# EasyEDA Pro project ProProject_MSPM0小红板_2025-07-22.epro, board 2.1
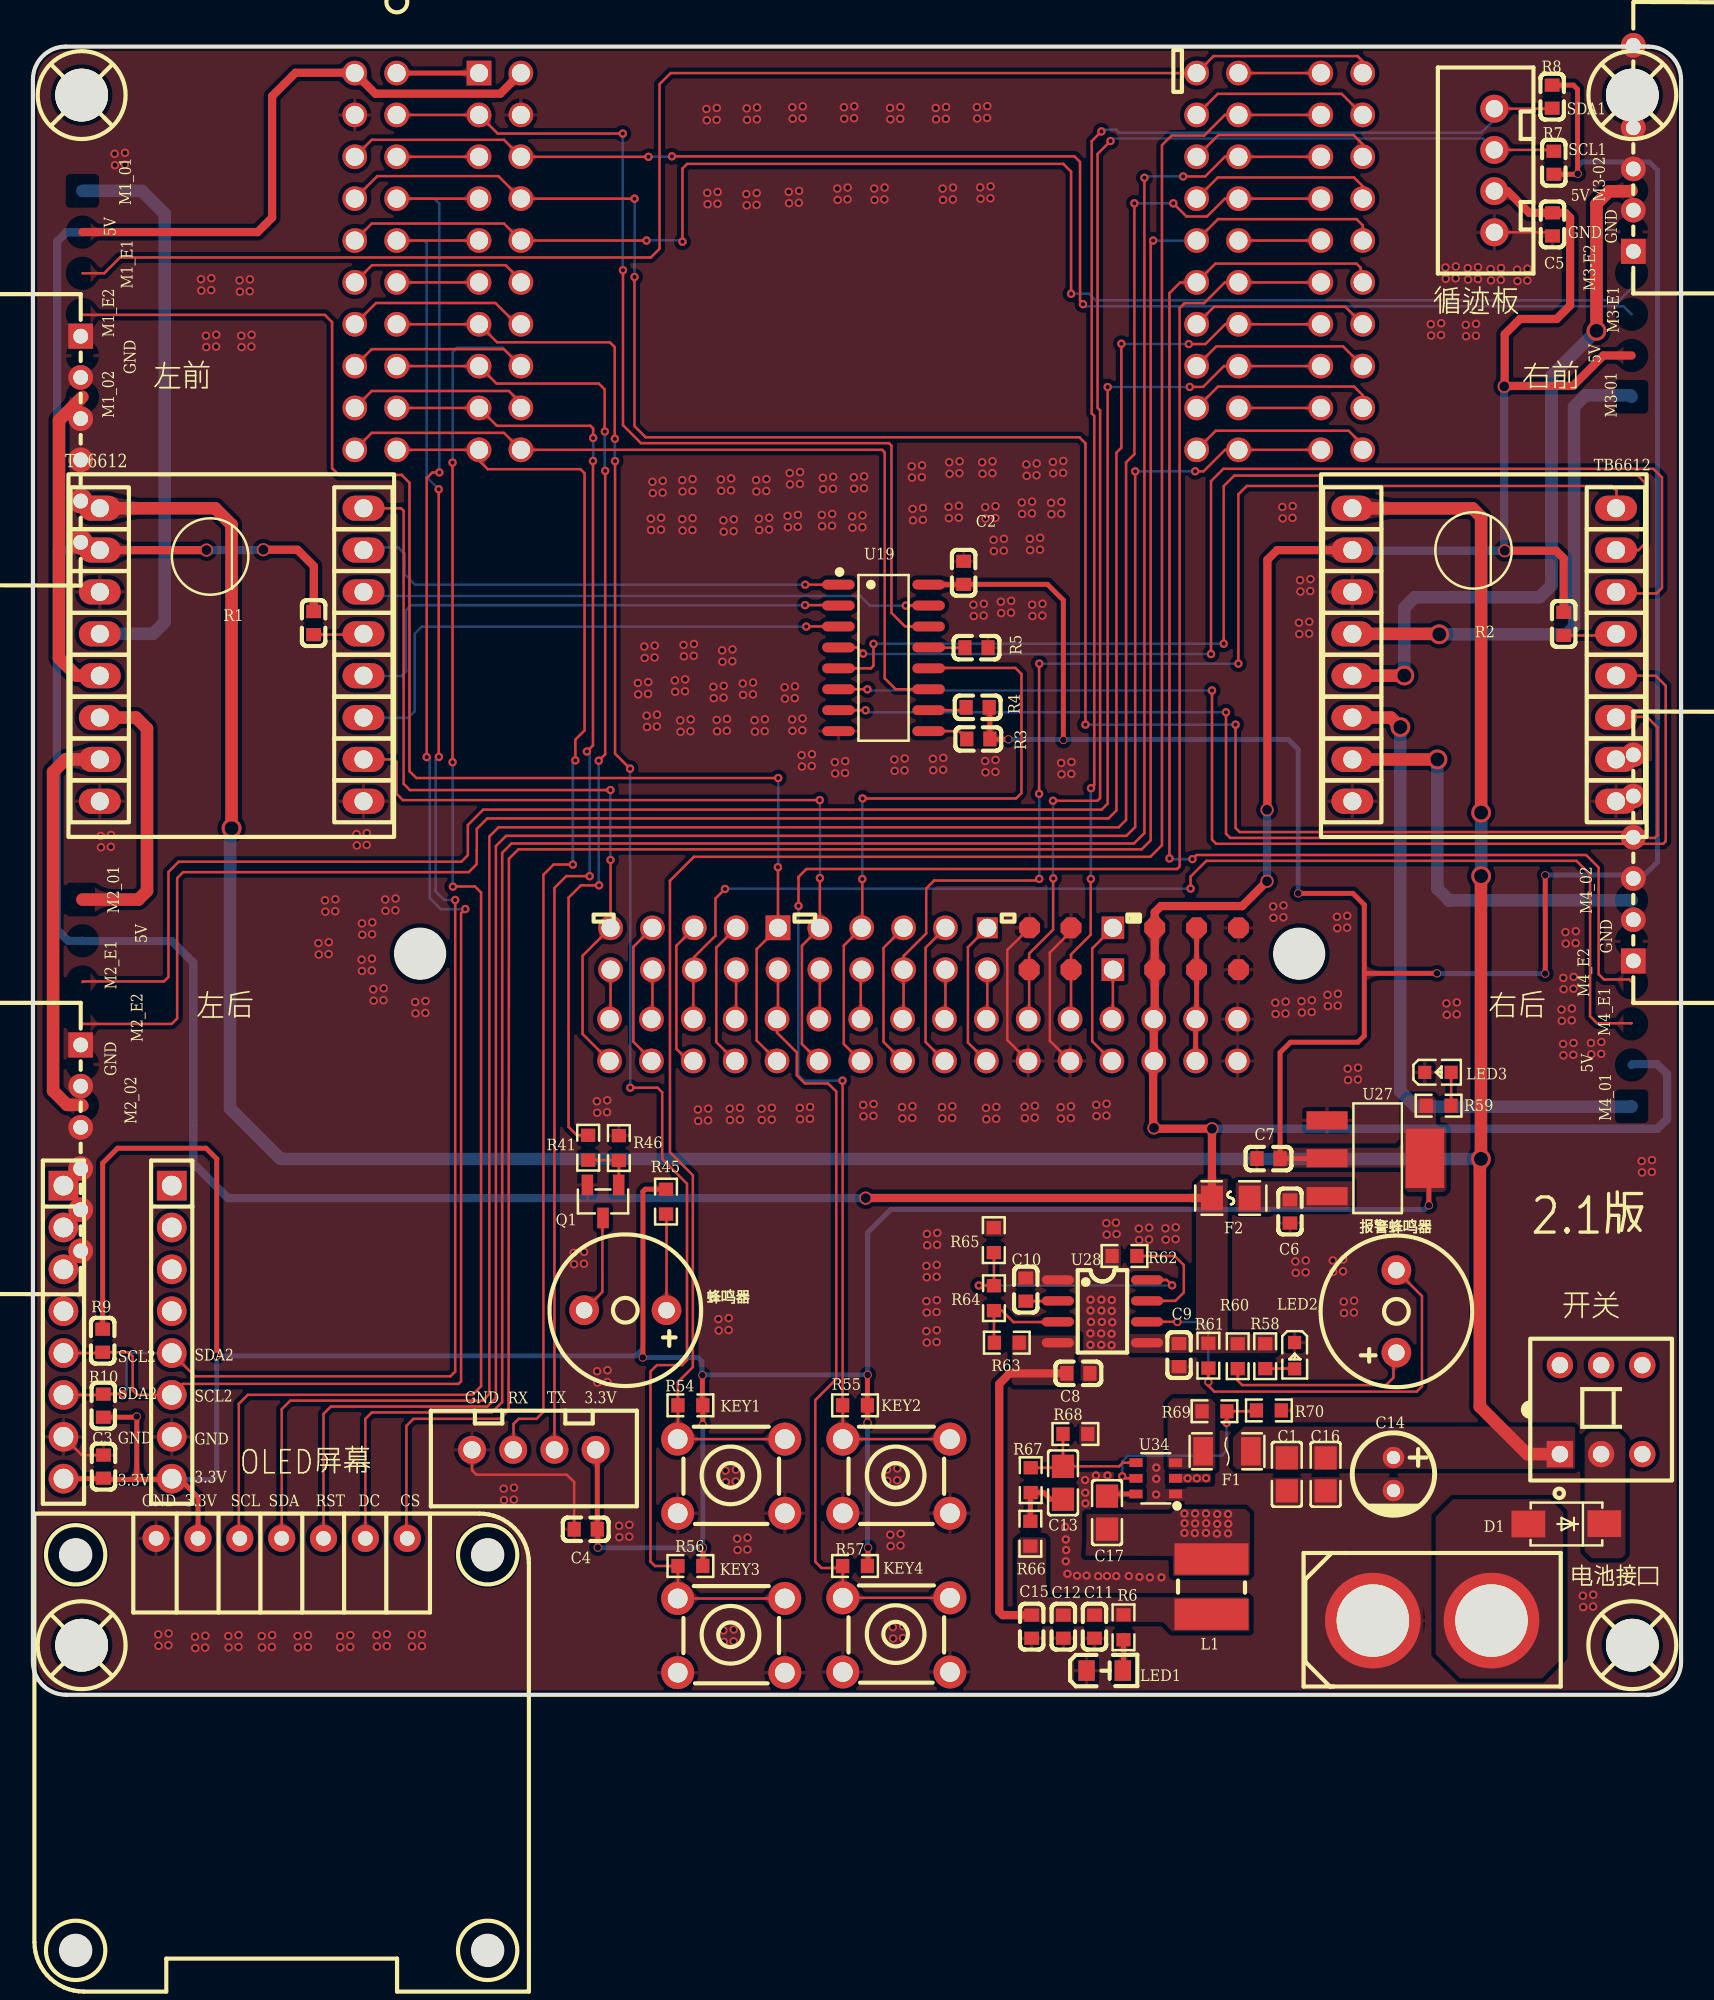
[diagram p2: board, top side]
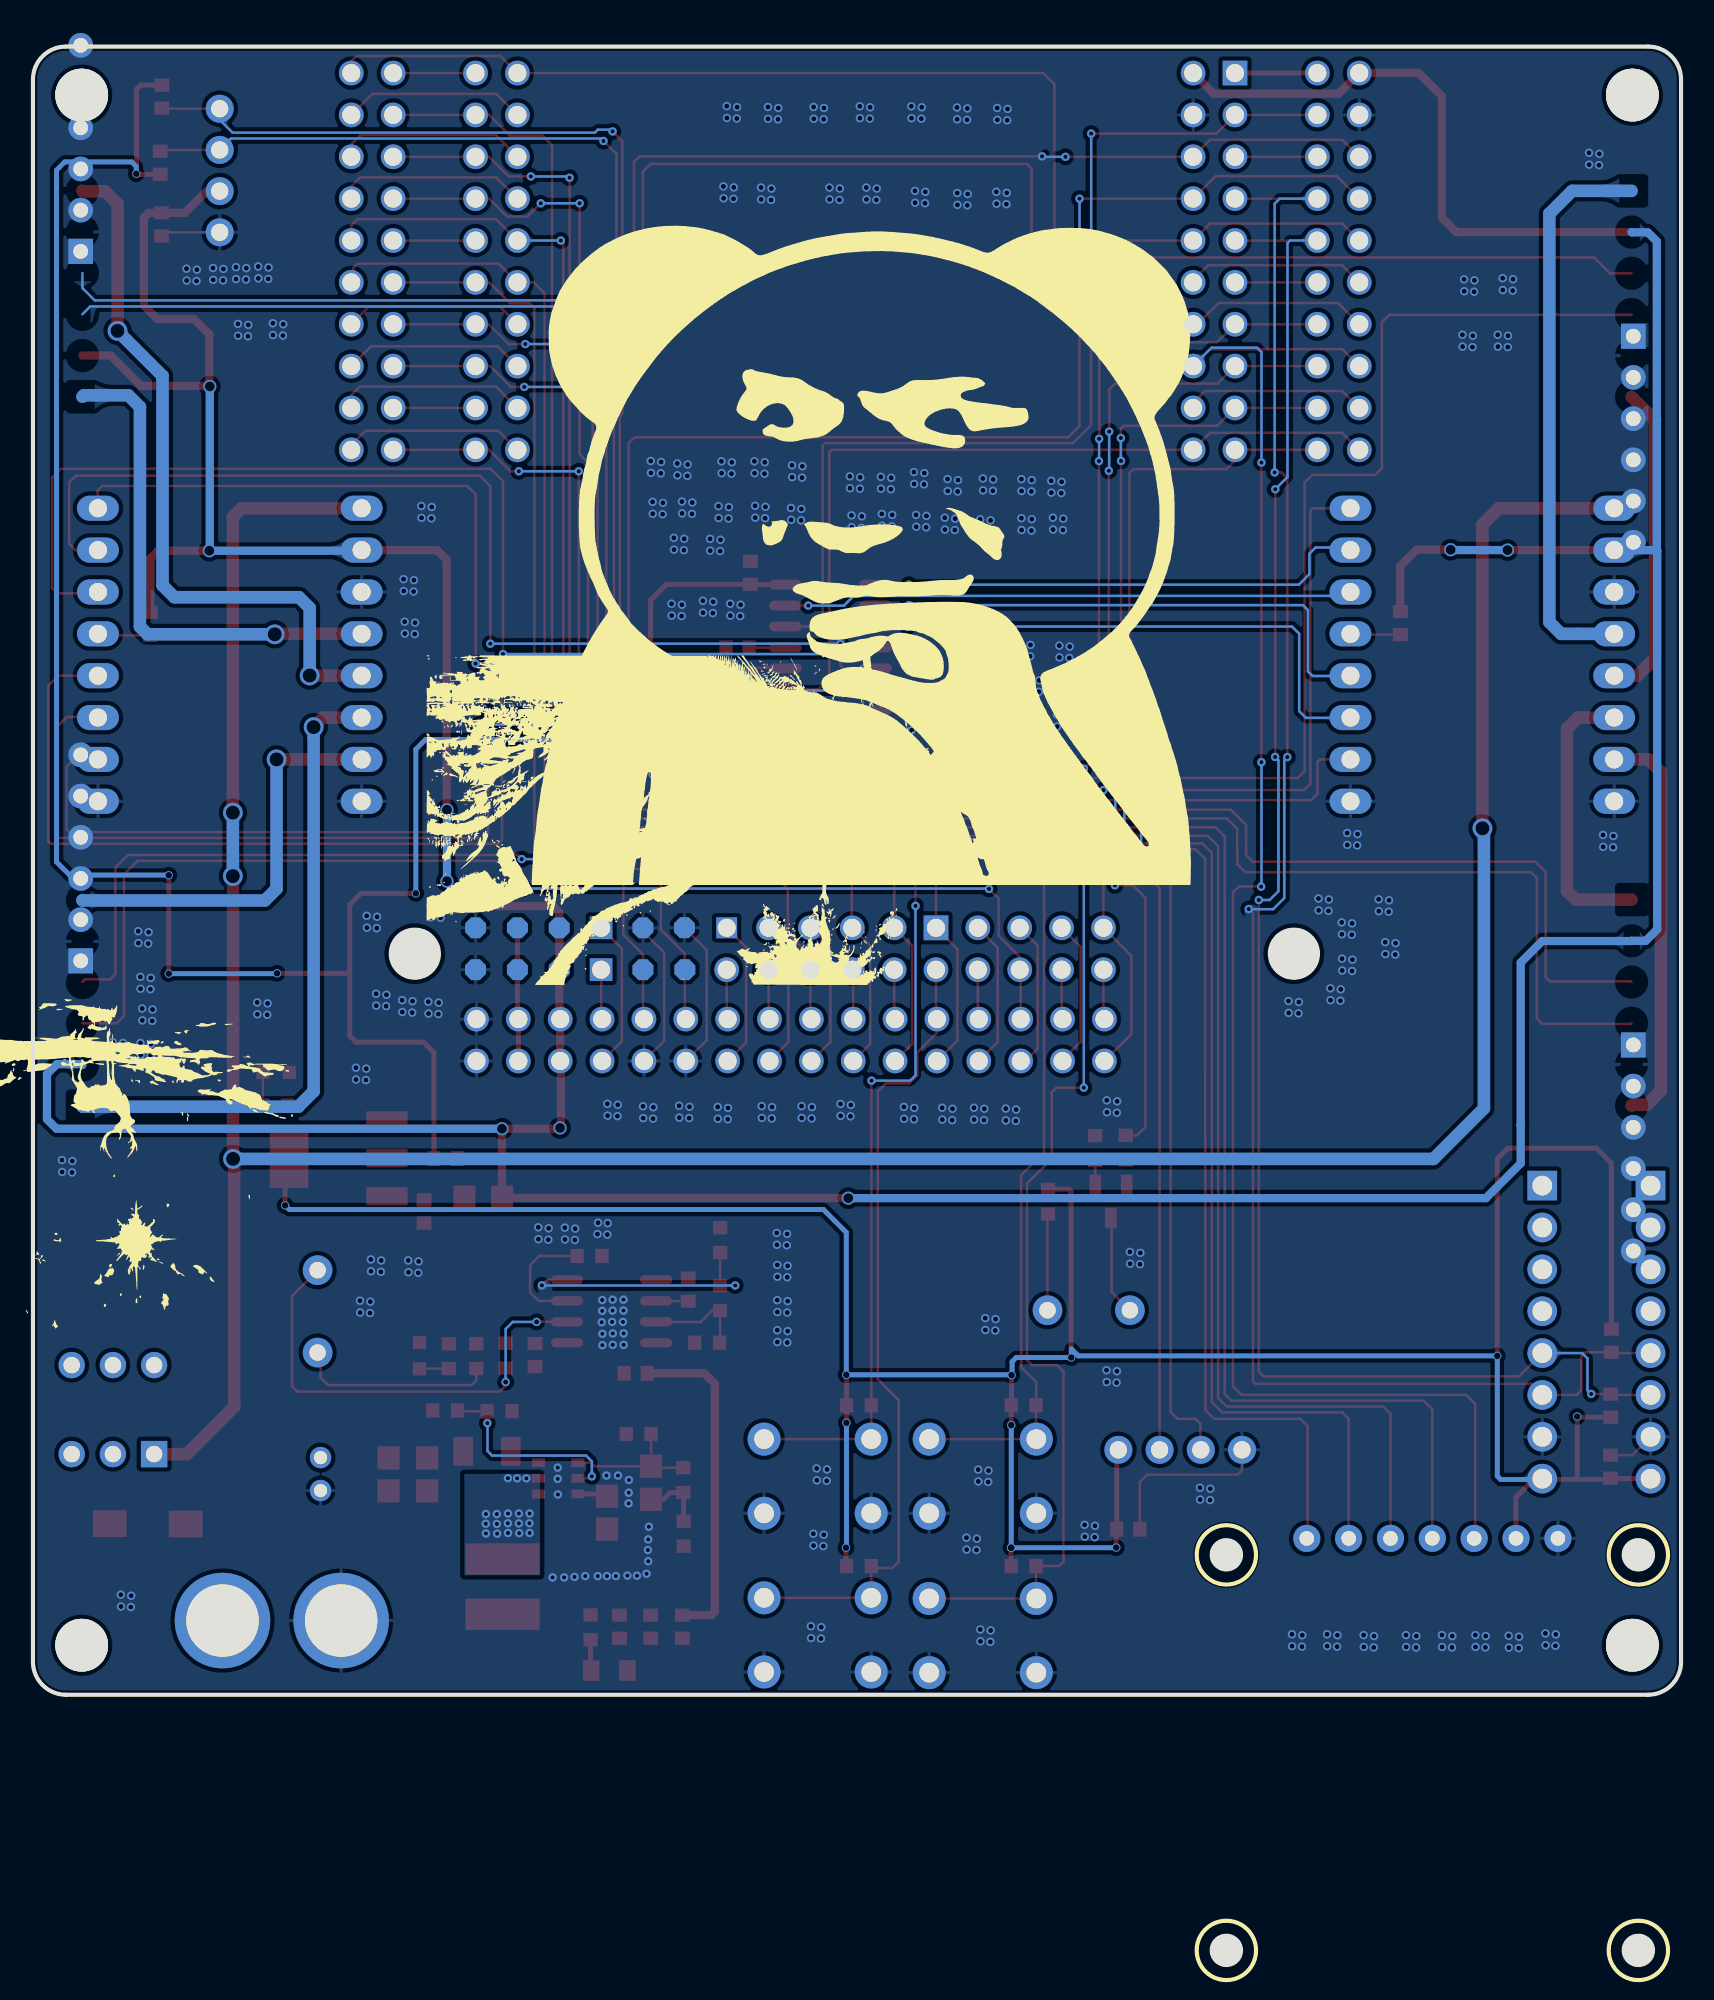
[diagram p3: board, bottom side, seen from below]

Outline 100 x 116.52 mm; copper layers: Top Layer, Bottom Layer. Coordinates in mm from the lower left corner of the outline.
Outline path: 0,114.52 0,18.52 arc(0.59,17.11) 2,16.52 98,16.52 arc(99.41,17.11) 100,18.52 100,114.52 arc(99.41,115.94) 98,116.52 2,116.52 arc(0.59,115.94) 0,114.52
Stack: Top Layer 0.035mm / Dielectric1 1.51mm FR4 er 4.5 / Bottom Layer 0.035mm

## Design rules (mm)
net 12V: 12
net +12V: 12
net DC5V: 5
net DC12V: 12
net M1_O2: 12
net 5V: 5
net M2_O2: 12
net M2_O1: 12
net M1_O1: 12
net +3.3V: 3.3
net $1N17140: 3.3
net M4_O1: 12
net M4_O2: 12
net M3_O1: 12
net M3_O2: 12
template: TI板
spacing copperThickness1oz (default): track to track 0.203, other pairs 0.152 to 0.203
spacing copperThickness2oz: track to track 0.203, other pairs 0.152 to 0.3
track width 信号线 (default): min 0.152, default 0.152, max 0.3
track width 12v: min 0.762, default 0.762, max 0.762
track width 3v3: min 0.3, default 0.3, max 0.4
track width 5电源线: min 0.5, default 0.5, max 2.54
differential pair differentialPair (default): width min 0.152, default 0.152, max 0.152; gap min 0.152, default 0.152
via 信号线孔 (default): diameter min 0.508, default 0.508, max 0.508; hole min 0.254, default 0.254, max 0.305
via 12v: diameter min 0.762, default 1.27, max 2.032; hole min 0.762, default 0.889, max 2.032
via 3v3: diameter min 0.4, default 0.6, max 1; hole min 0.4, default 0.4, max 0.6
via 5v电源: diameter min 0.5, default 0.8, max 10; hole min 0.3, default 0.6, max 6.3
net class 12 uses 12v
net class 5 uses 5v电源, 5电源线
net class 3.3 uses 3v3
net 12V uses 12v
net +12V uses 12v
net DC5V uses 5v电源, 5电源线
net DC12V uses 12v
net M1_O2 uses 12v
net 5V uses 5v电源, 5电源线
net M2_O2 uses 12v
net M2_O1 uses 12v
net M1_O1 uses 12v
net +3.3V uses 3v3
net $1N17140 uses 3v3
net M4_O1 uses 12v
net M4_O2 uses 12v
net M3_O1 uses 12v
net M3_O2 uses 12v

## Placement (name value [footprint] x y rotation side)
BUZZER3  3kHz  [BUZ-TH_BD9.0-P5.00-D0.6-FD]  35.94 39.85 180 top
BUZZER4  3kHz  [BUZ-TH_BD9.0-P5.00-D0.6-FD]  82.73 39.78 90 top
C1  100nF  [C0805]  76.08 29.89 90 top
C2  100nF  [C0603]  56.47 84.59 90 top
C3  100nF  [C0603]  4.28 30.36 270 top
C4  100nF  [C0603]  33.54 26.56 180 top
C5  100nF  [C0603]  92.2 105.73 90 top
C6  100nF  [C0603]  76.27 45.84 90 top
C7  100nF  [C0603]  74.97 49.05 0 top
C8  100nF  [C0603]  63.43 36.02 180 top
C9  100nF  [C0603]  69.54 37.13 90 top
C10  1NF  [C0603]  60.24 41.1 270 top
C11  0.1uF  [C0603]  64.41 20.65 90 top
C12  22uF  [C0603]  62.52 20.65 90 top
C13  75pf  [C0805]  62.5 29.38 270 top
C14  47uF  [CAP-TH_BD5.0-P2.00-D0.8-FD]  82.55 29.91 270 top
C15  22uF  [C0603]  60.6 20.65 90 top
C16  10uF  [C0805]  78.43 29.89 90 top
C17  100nF  [C0805]  65.17 27.57 90 top
D1  SS54  [SMA_L4.3-W2.6-LS5.0-FD]  93.04 26.89 0 top
F1  nSMD010  [F1206]  72.45 31.29 180 top
F2  SMD0805-050-24  [F0805]  72.68 46.66 0 top
H1  -  [HDR-TH_8P-P2.54-V-F-1]  8.42 38.52 270 top
H1#2  -  [HDR-TH_8P-P2.54-V-F-1]  1.85 38.52 270 top
KEY1  K3  [KEY-TH_4P-L6.0-W6.0-P4.50]  42.37 29.78 0 top
KEY2  K3  [KEY-TH_4P-L6.0-W6.0-P4.50]  52.39 29.78 0 top
KEY3  K3  [KEY-TH_4P-L6.0-W6.0-P4.50]  42.37 20.11 0 top
KEY4  K3  [KEY-TH_4P-L6.0-W6.0-P4.50]  52.39 20.15 0 top
L1  10uH  [IND-SMD_L4.5-W4.0_SCD0403T]  71.51 23.08 270 top
LED1  -  [LED_0805]  65.08 17.98 0 top
LED2  -  [LED_0603]  76.56 37.04 270 top
LED3  -  [LED_0603]  85.3 54.29 0 top
Q1  AO3400A  [SOT-23-3_L2.9-W1.3-P1.90-LS2.4-BR]  34.59 46.45 90 top
R1  10K  [C0603]  17.03 81.54 90 top
R2  10K  [C0603]  92.88 81.49 90 top
R3  10K  [C0603]  57.36 74.51 0 top
R4  10K  [C0603]  57.32 76.43 0 top
R5  10K  [C0603]  57.25 80.05 0 top
R6  5K  [R0603]  66.17 20.61 90 top
R7  4.7K  [C0603]  92.28 109.47 90 top
R8  4.7K  [C0603]  92.18 113.48 270 top
R9  4.7K  [C0603]  4.23 38 270 top
R10  4.7K  [C0603]  4.27 34.06 90 top
R41  22R  [R0603]  33.69 49.71 90 top
R45  100R  [R0603]  38.41 46.44 270 top
R46  10K  [R0603]  35.55 49.69 270 top
R54  10K  [R0603]  39.89 34.08 180 top
R55  10K  [R0603]  49.88 34.08 180 top
R56  10K  [R0603]  39.89 24.33 180 top
R57  10K  [R0603]  49.88 24.33 180 top
R58  10K  [R0603]  74.77 37.06 90 top
R59  2k  [R0603]  85.29 52.26 180 top
R60  100R  [R0603]  73.1 37.06 270 top
R61  10K  [R0603]  71.32 37.09 270 top
R62  75K  [R0603]  66.23 43.14 180 top
R63  150K  [R0603]  59.09 37.88 180 top
R64  36K  [R0603]  58.31 40.58 90 top
R65  47K  [R0603]  58.3 44.1 270 top
R66  49.9  [R0603]  60.52 26.29 270 top
R67  100K  [R0603]  60.54 29.54 270 top
R68  13.3K  [R0603]  63.25 32.34 180 top
R69  511K  [R0603]  71.69 33.72 180 top
R70  105K  [R0603]  74.99 33.77 180 top
SCREW1  -  [M3螺丝]  2.95 19.53 0 top
SCREW2  -  [M3螺丝]  97.04 113.58 0 top
SCREW3  -  [M3螺丝]  97.04 19.53 0 top
SCREW4  -  [M3螺丝]  2.95 113.58 0 top
SW1  XKB8585-Z-150  [SW-TH_6P-L8.5-W8.5-P2.50-LS5.4-BL-1]  95.15 33.82 0 top
TB6612  -  [TB6612]  78 68.52 0 top
U1  -  [MSPM0G3507]  47.48 90.02 0 top
U3  -  [TB6612]  2 68.52 0 top
U11  OLED_SPI  [0.96OLED_7P]  15.09 26.01 0 top
U18  PCA9555  [CONN-TH_4P-P2.50-XH2.54-4P]  88.67 109 270 top
U19  74HC595D,118  [SOIC-16_L9.9-W3.9-P1.27-LS6.0-BL]  51.61 79.43 270 top
U21  UART1  [CONN-TH_4P-P2.50-XH2.54-4P]  30.39 31.38 0 top
U22  -  [ZX-XH2.54-6PWZ]  3 101.52 270 top
U23  -  [ZX-XH2.54-6PWZ]  3 58.52 270 top
U24  -  [ZX-XH2.54-6PWZ]  97 101.52 90 top
U25  -  [ZX-XH2.54-6PWZ]  97 58.47 90 top
U27  A1117-3.3  [SOT-223-3_L6.5-W3.4-P2.30-LS7.0-BR-1]  81.49 49.07 180 top
U28  TPS25921ADR  [SOIC-8_L5.0-W4.0-P1.27-LS6.0-BL]  64.89 39.78 270 top
U29  XT60  [CONN-TH_XT60]  84.9 21.02 0 top
U34  TPS54302DDCT  [TSOT-23-6_L2.9-W1.6-P0.95-LS2.8-BR]  68.13 29.65 0 top

## Footprints (pads in the part's own frame, mm; a bottom-side part is the same pattern mirrored in y, then rotated)
0.96OLED_7P
  round 1.651 hole 0.889: 1(-7.617,0.003) 2(-5.077,-0.003) 3(-2.538,-0.003) 4(0.003,0.005) 5(2.54,0) 6(5.08,0) 7(7.62,-0.003)
BUZ-TH_BD9.0-P5.00-D0.6-FD
  round 1.8 hole 1: 1(-2.5,0) 2(2.5,0)
C0603
  rect 0.8x0.9 smd: 1(-0.7,0) 2(0.7,0)
C0805
  rect 1.41x1.35 smd: 1(-1,0) 2(1,0)
CAP-TH_BD5.0-P2.00-D0.8-FD
  round 1.3 hole 0.8: 1(-1,0) 2(1,0)
CONN-TH_4P-P2.50-XH2.54-4P
  round 1.7 hole 1.05: 1(3.75,0) 2(1.25,0) 3(-1.25,0) 4(-3.75,0)
CONN-TH_XT60
  round 5.8 hole 4.4: 1(-3.6,0) 2(3.6,0)
F0805
  rect 1.335x1.5 smd: 1(-1.143,0) 2(1.143,0)
F1206
  rect 1.19x1.728 smd: 1(-1.445,0) 2(1.445,0)
HDR-TH_8P-P2.54-V-F-1
  rect 1.8x1.8 hole 1.2: 1(-8.89,0)
  round 1.8 hole 1.2: 2(-6.35,0) 3(-3.81,0) 4(-1.27,0) 5(1.27,0) 6(3.81,0) 7(6.35,0) 8(8.89,0)
IND-SMD_L4.5-W4.0_SCD0403T
  rect 1.9x4.5 smd: 1(-1.675,0) 2(1.675,0)
KEY-TH_4P-L6.0-W6.0-P4.50
  round 2 hole 1.2: 1(-3.25,-2.25) 2(3.25,-2.25) 3(3.25,2.25) 4(-3.25,2.25)
LED_0603
  rect 0.8x0.8 smd: 1(-0.851,-0.01) 2(0.75,-0.005)
LED_0805
  rect 1x1.25 smd: 1(-1.15,0.005) 2(1.05,0.005)
M3螺丝
  round 3.2 hole 3.2: 1(0,0)
MSPM0G3507
  round 1.5 hole 1.1: 1(-25.412,24.892) 2(-27.952,24.892) 2(-17.872,24.892) 3(-25.412,22.352) 3(-20.412,22.352) 4(-27.952,22.352) 4(-17.872,22.352) 5(-25.412,19.812) 5(-20.412,19.812) 6(-27.952,19.812) 6(-17.872,19.812) 7(-25.412,17.272) 7(-20.412,17.272) 8(-27.952,17.272) 8(-17.872,17.272) 9(-25.412,14.732) 9(-20.412,14.732) 10(-27.952,14.732) 10(-17.872,14.732) 11(-25.412,12.192) 11(-20.412,12.192) 12(-27.952,12.192) 12(-17.872,12.192) 13(-25.412,9.652) 13(-20.412,9.652) 14(-27.952,9.652) 14(-17.872,9.652) 15(-25.412,7.112) 15(-20.412,7.112) 16(-27.952,7.112) 16(-17.872,7.112) 17(-25.412,4.572) 17(-20.412,4.572) 18(-27.952,4.572) 18(-17.872,4.572) 19(-25.412,2.032) 19(-20.412,2.032) 20(-27.952,2.032) 20(-17.872,2.033) 21(23.128,24.892) 21(33.208,24.892) 22(25.668,24.892) 22(30.668,24.892) 23(23.128,22.352) 23(33.208,22.352) 24(25.668,22.352) 24(30.668,22.352) 25(23.128,19.812) 25(33.208,19.812) 26(25.668,19.812) 26(30.668,19.812) 27(23.128,17.272) 27(33.208,17.272) 28(25.668,17.272) 28(30.668,17.272) 29(23.128,14.732) 29(33.208,14.732) 30(25.668,14.732) 30(30.668,14.732) 31(23.128,12.192) 31(33.208,12.192) 32(25.668,12.192) 32(30.668,12.192) 33(23.128,9.652) 33(33.208,9.652) 34(25.668,9.652) 34(30.668,9.652) 35(23.128,7.112) 35(33.208,7.112) 36(25.668,7.112) 36(30.668,7.112) 37(23.128,4.572) 37(33.208,4.572) 38(25.668,4.572) 38(30.668,4.572) 39(23.128,2.032) 39(33.208,2.032) 40(25.668,2.032) 40(30.668,2.032) 41(-12.49,-35.048) 41(-12.431,-26.968) 42(-12.49,-32.508) 42(-12.431,-29.508) 43(-9.95,-35.048) 43(-9.892,-26.968) 44(-9.95,-32.508) 44(-9.892,-29.508) 45(-7.41,-35.048) 45(-7.351,-26.968) 46(-7.41,-32.508) 46(-7.351,-29.508) 47(-4.87,-35.048) 47(-4.811,-26.968) 48(-4.87,-32.508) 48(-4.811,-29.508) 49(-2.33,-35.048) 50(-2.33,-32.508) 50(-2.272,-29.508) 51(0.21,-35.048) 51(0.269,-26.968) 52(0.21,-32.508) 52(0.269,-29.508) 53(2.75,-35.048) 53(2.808,-26.968) 54(2.75,-32.508) 54(2.808,-29.508) 55(5.29,-35.048) 55(5.348,-26.968) 56(5.29,-32.508) 56(5.348,-29.508) 57(7.83,-35.048) 57(7.888,-26.968) 58(7.83,-32.508) 58(7.888,-29.508) 59(10.37,-35.048) 60(10.37,-32.508) 60(10.428,-29.508) 61(12.91,-35.048) 62(12.91,-32.508) 63(15.45,-35.048) 64(15.45,-32.508) 65(17.99,-35.048) 66(17.99,-32.508) 67(20.53,-35.048) 68(20.53,-32.508) 69(23.07,-35.048) 70(23.07,-32.508) 71(25.61,-35.048) 72(25.61,-32.508)
  rect 1.5x1.5 hole 1.1: 1(-20.412,24.892) 49(-2.272,-26.968)
  rect 1.267x1.267 hole 1.1: 59(10.428,-26.968)
  custom 1.267x1.267 hole 1.1: 61(12.992,-26.962)
  custom 1.268x1.267 hole 1.1: 62(12.969,-29.508) 63(15.508,-26.968) 64(15.508,-29.508) 67(20.588,-26.968) 68(20.588,-29.508) 69(23.128,-26.968) 70(23.128,-29.508) 71(25.668,-26.968) 72(25.668,-29.508)
  rect 1.371x1.371 hole 1.1: 65(18.049,-26.968) 66(18.049,-29.508)
R0603
  rect 0.806x0.864 smd: 1(-0.753,0) 2(0.753,0)
SMA_L4.3-W2.6-LS5.0-FD
  rect 2.046x1.62 smd: 1(-2.304,-0.009) 2(2.304,0.009)
SOIC-8_L5.0-W4.0-P1.27-LS6.0-BL
  oval 0.569x1.95 smd: 1(-1.905,-2.705) 2(-0.635,-2.705) 3(0.635,-2.705) 4(1.905,-2.705) 5(1.905,2.705) 6(0.635,2.705) 7(-0.635,2.705) 8(-1.905,2.705)
SOIC-16_L9.9-W3.9-P1.27-LS6.0-BL
  oval 0.602x1.971 smd: 1(-4.445,-2.736) 2(-3.175,-2.736) 3(-1.905,-2.736) 4(-0.635,-2.736) 5(0.635,-2.736) 6(1.905,-2.736) 7(3.175,-2.736) 8(4.445,-2.736) 9(4.445,2.736) 10(3.175,2.736) 11(1.905,2.736) 12(0.635,2.736) 13(-0.635,2.736) 14(-1.905,2.736) 15(-3.175,2.736) 16(-4.445,2.736)
SOT-23-3_L2.9-W1.3-P1.90-LS2.4-BR
  rect 1.25x0.7 smd: 1(1,-0.95) 2(1,0.95) 3(-1,0)
SOT-223-3_L6.5-W3.4-P2.30-LS7.0-BR-1
  rect 2.5x1.1 smd: 1(2.97,-2.3) 2(2.97,0) 3(2.97,2.3)
  rect 2.34x3.6 smd: 2(-2.97,0)
SW-TH_6P-L8.5-W8.5-P2.50-LS5.4-BL-1
  rect 1.6x1.6 hole 1: 1(-2.5,-2.7)
  round 1.6 hole 1: 2(0,-2.7) 3(2.5,-2.7) 4(2.5,2.7) 5(0.001,2.7) 6(-2.5,2.7)
TB6612
  oval 2.54x1.524 hole 1.1: 1(2.057,19.988) 2(2.057,17.448) 3(2.057,14.908) 4(2.057,12.368) 5(2.057,9.828) 6(2.057,7.288) 7(2.057,4.748) 8(2.057,2.208) 9(18.057,2.208) 10(18.057,4.748) 11(18.057,7.288) 12(18.057,9.828) 13(18.057,12.368) 14(18.057,14.908) 15(18.057,17.448) 16(18.057,19.988)
TSOT-23-6_L2.9-W1.6-P0.95-LS2.8-BR
  rect 0.8x0.532 smd: 1(1.2,-0.95) 2(1.2,0) 3(1.2,0.95) 4(-1.2,0.95) 5(-1.2,0) 6(-1.2,-0.95)
ZX-XH2.54-6PWZ
  rect 1.524x1.5 hole 0.9: 1(2.575,-0.104)
  round 1.5 hole 0.9: 2(5.074,-0.104) 3(7.574,-0.104) 4(10.075,-0.104) 5(12.575,-0.104) 6(15.075,-0.104)

## Nets
5V: C5.2 C9.2 F2.1 R1.2 R2.2 R58.2 R60.1 R61.1 TB6612.2 U1.2 U1.67 U1.68 U3.2 U18.2 U22.2 U23.2 U24.2 U25.2 U28.5
12V: C1.2 C14.1 C16.2 F1.1 SW1.1 TB6612.1 U3.1
+3.3V: C2.1 C3.2 C4.1 C7.2 H1.8 H1#2.8 R3.2 R4.2 R7.1 R8.1 R9.1 R10.1 R45.1 R54.1 R55.1 R56.1 R57.1 R59.2 U11.2 U19.16 U21.1 U27.2
+12V: D1.2 SW1.2
GND: C1.1 C2.2 C3.1 C4.2 C5.1 C6.1 C7.1 C8.1 C9.1 C10.1 C11.1 C12.1 C14.2 C15.1 C16.1 H1.7 H1#2.7 KEY1.1 KEY1.2 KEY2.1 KEY2.2 KEY3.1 KEY3.2 KEY4.1 KEY4.2 LED1.1 LED2.1 LED3.1 Q1.2 R5.2 R46.1 R62.2 R65.1 R68.1 R70.1 TB6612.3 TB6612.8 TB6612.9 U1.4 U1.61 U1.63 U1.71 U1.72 U3.3 U3.8 U3.9 U11.1 U18.1 U19.8 U21.4 U22.5 U23.5 U24.5 U25.5 U27.1 U28.1 U29.1 U34.1
595DS: U1.3 U19.14
595SHCP: U1.20 U19.11
595STCP: U1.53 U19.12
BEEP: R41.2 U1.15
DC5V: C8.2 C11.2 C12.2 C15.2 L1.2 R6.2 R63.1 R66.2 U28.4
DC12V: D1.1 U29.2
EN: R69.1 R70.2 U34.5
ENUV: R63.2 R64.1 U28.3
FB: C13.1 R67.1 R68.2 U34.4
KEY1: KEY1.3 KEY1.4 R54.2 U1.24
KEY2: KEY2.3 KEY2.4 R55.2 U1.32
KEY3: KEY3.3 KEY3.4 R56.2 U1.13
KEY4: KEY4.3 KEY4.4 R57.2 U1.50
M1_E1: U1.21 U22.3
M1_E2: U1.49 U22.4
M1_IN1: U3.14 U19.15
M1_IN2: U3.15 U19.1
M1_O1: U3.4 U22.1
M1_O2: U3.5 U22.6
M1_PWM: U1.41 U3.16
M2_E1: U1.36 U23.3
M2_E2: U1.34 U23.4
M2_IN1: U3.12 U19.2
M2_IN2: U3.11 U19.3
M2_O1: U3.6 U23.1
M2_O2: U3.7 U23.6
M2_PWM: U1.51 U3.10
M3_E1: U1.6 U24.3
M3_E2: U1.10 U24.4
M3_IN1: TB6612.14 U19.4
M3_IN2: TB6612.15 U19.5
M3_O1: TB6612.4 U24.1
M3_O2: TB6612.5 U24.6
M3_PWM: TB6612.16 U1.56
M4_E1: U1.46 U25.3
M4_E2: U1.31 U25.4
M4_IN1: TB6612.12 U19.6
M4_IN2: TB6612.11 U19.7
M4_O1: TB6612.6 U25.1
M4_O2: TB6612.7 U25.6
M4_PWM: TB6612.10 U1.8
OLED_CS: U1.29 U11.7
OLED_DC: U1.26 U11.6
OLED_RST: U1.40 U11.5
OLED_SCL: U1.16 U11.3
OLED_SDA: U1.28 U11.4
OVP: R64.2 R65.2 U28.8
RX1: U1.19 U21.3
SCL1: R7.2 U1.62 U18.3
SCL2: H1.6 H1#2.5 R9.2 U1.7
SDA1: R8.2 U1.64 U18.4
SDA2: H1.5 H1#2.6 R10.2 U1.9
SW: C17.1 L1.1 U34.2
TX1: U1.17 U21.2
$1N3300: R1.1 U3.13
$1N3306: R2.1 TB6612.13
$1N3954: R3.1 U19.9
$1N3999: R4.1 U19.10
$1N4038: R5.1 U19.13
$1N7178: Q1.1 R41.1 R46.2
$1N9172: LED2.2 R58.1
$1N14720: BUZZER3.1 R45.2
$1N14723: BUZZER3.2 Q1.3
$1N15095: LED3.2 R59.1
$1N16674: C17.2 U34.6
$1N16686: F1.2 R69.2 U34.3
$1N17004: C13.2 R66.1 R67.2
$1N17013: LED1.2 R6.1
$1N17140: C6.2 F2.2 U27.3
$1N22095: BUZZER4.1 R60.2
$1N22604: C10.2 U28.2
$1N22844: R62.1 U28.7
$1N22851: BUZZER4.2 R61.2 U28.6

Pads without a net: H1 1 2 3 4; H1#2 1 2 3 4; SCREW1 1; SCREW2 1; SCREW3 1; SCREW4 1; SW1 3 4 5 6; U1 1 5 11 12 14 18 22 23 25 27 30 33 35 37 38 39 42 43 44 45 47 48 52 54 55 57 58 59 60 65 66 69 70

## Via types
v1: diameter 0.508, hole 0.305, Top Layer to Bottom Layer, 562 vias
v2: diameter 0.508, hole 0.254, Top Layer to Bottom Layer, 142 vias
v3: diameter 1.2, hole 0.85, Top Layer to Bottom Layer, 9 vias
v4: diameter 0.8, hole 0.6, Top Layer to Bottom Layer, 9 vias
v5: diameter 0.5, hole 0.4, Top Layer to Bottom Layer, 11 vias
v6: diameter 0.508, hole 0.4, Top Layer to Bottom Layer, 8 vias

## Routing (per net, layer and track width the routed paths; a pad name or vN(x,y) marks a point on that pad's centre or on a via; arc(x,y) is an arc through that point)
5V: length 322.1
  Top Layer w0.5: 89.3,95.93 89.3,99.06 90.23,99.99 92.45,99.99 93.27,100.81 93.27,106.14 92.98,106.43 C5.2 90.79,106.43 89.47,107.75 U18.2 ; 89.3,95.93 v4(89.27,95.9) ; 89.3,95.93 93.44,95.93 95.29,97.78 97,97.78 ; R1.2 17.04,82.25 17.04,85 16.05,85.99 v4(13.98,85.99) ; R2.2 92.88,85.47 92.42,85.93 v4(89.3,85.93) ; U3.2 10.53,85.97 v4(10.53,85.97) ; U1.2 28.35,113.66 20.78,113.66 U1.2 19.51,114.93 15.93,114.93 14.51,113.51 14.51,106.14 13.63,105.27 3,105.27 ; v4(74.88,65.88) 73.37,64.37 68.44,64.37 68.07,64 U1.67 U1.68 68.07,57.57 U1.68 U1.67 67.97,54.94 67.97,50.86 v4(71.54,50.86) 71.54,50.86 F2.1 50.54,46.66 v4(50.53,46.65) ; TB6612.2 75.49,85.97 74.9,85.38 74.9,70.23 v4(74.88,70.21)
  Bottom Layer w0.5: 1.45,85.86 1.45,85.97 1.47,85.97 ; 1.45,85.86 1.47,85.97 ; 1.45,85.86 1.45,62.95 2.14,62.27 3,62.27 3.01,62.25 8.42,62.25 9.73,60.94 9.73,51.07 ; v4(10.53,85.97) 13.96,85.97 v4(13.98,85.99) ; 1.47,85.97 1.47,104.7 2.02,105.25 2.99,105.25 3,105.27 ; 1.47,85.97 U3.2 ; 9.73,51.07 9.71,51.09 ; 9.73,51.07 9.73,48.76 11.84,46.65 v4(50.53,46.65) ; TB6612.2 80.1,85.93 v4(89.3,85.93) 89.27,85.96 v4(89.27,95.9) ; v4(74.88,70.21) v4(74.88,65.88) ; 97,54.73 97.05,54.78 98.55,54.78 99.15,54.18 99.15,51.44 98.57,50.86 v4(71.54,50.86)
  vias: v4(68.02,50.91)
12V: length 189.1
  Top Layer w0.762: U3.1 11.05,88.51 12.05,87.51 v3(12.05,69.09) ; SW1.1 90.67,31.12 87.79,34 87.79,48.96 v3(87.86,49.03) 87.86,66.18 v3(87.87,66.19) ; TB6612.1 80.07,88.5 87.35,88.5 87.87,87.98 v3(87.87,70.04)
  Bottom Layer w0.762: v3(87.87,66.19) v3(87.87,70.04) ; 4.07,88.52 U3.1 ; v3(12.05,69.09) 11.96,69 11.96,52.09 15.02,49.03 v3(87.86,49.03)
+3.3V: length 344.9
  Top Layer w0.3: R56.1 40.65,24.34 v6(40.65,25.44) ; R8.1 93.47,114.18 93.72,113.93 93.72,108.77 R7.1 ; v6(40.62,35.91) 40.62,34.1 R54.1 40.64,32.88 v6(40.64,32.88) ; R10.1 6.26,33.36 v5(6.3,33.4) 6.3,29.62 ; v6(34.27,25.45) 34.27,26.53 C4.1 34.24,31.28 U21.1 ; v5(91.76,66.24) v5(91.76,60.27) ; v5(62.52,74.45) 62.52,82.93 61.56,83.89 C2.1 56.45,83.88 U19.16 ; v5(84.7,46.21) 84.7,48.83 U27.2 ; R4.2 58.06,76.39 R3.2 58.08,74.49 v5(59.19,74.49) ; U27.2 78.5,49.05 C7.2 75.67,55.48 76.3,56.11 80.39,56.11 80.78,56.5 80.78,64.45 80.09,65.14 v5(76.77,65.14) ; v5(37,36.98) 37.01,36.99 37.01,47.05 37.15,47.19 R45.1 ; H1#2.8 4.25,29.63 C3.2 ; 4.3,29.58 8.94,29.58 10.02,28.5 10.02,26.01 U11.2 ; v5(11.15,37.08) 11.15,49.03 10.5,49.68 5.13,49.68 4.23,48.78 R9.1 ; v5(85.19,60.29) 80.79,60.29 ; v6(50.67,25.44) 50.67,24.37 R57.1 ; v6(50.64,33.02) 50.63,33.03 R55.1 50.63,35.91 v6(50.65,35.93)
  Bottom Layer w0.3: H1.8 8.47,29.58 10.94,29.58 11.15,29.79 v5(11.15,37.08) 36.57,37.08 36.99,37.5 36.99,36.99 v5(37,36.98) 40.34,36.98 40.59,36.73 40.59,35.94 v6(40.62,35.91) 40.64,35.93 v6(50.65,35.93) 50.65,44.57 52.04,45.96 84.45,45.96 v5(84.7,46.21) ; v5(91.76,66.24) 91.77,66.25 97.77,66.25 98.57,67.05 98.57,109.02 98.07,109.52 94.01,109.52 93.73,109.24 v5(93.73,108.8) 93.72,108.81 ; v5(59.19,74.49) 59.2,74.48 76.17,74.48 76.77,73.88 v5(76.77,65.14) ; v5(91.76,60.27) 85.21,60.27 v5(85.19,60.29) ; v6(34.27,25.45) 34.28,25.44 v6(40.65,25.44) 40.64,25.45 v6(40.64,32.88) ; v6(50.67,25.44) 50.64,25.47 v6(50.64,33.02)
GND: length 35.4
  Top Layer w0.152: C5.1 91.98,105.25 U18.1 ; U1.63 62.99,62.84 61.7,61.55 61.7,56.2 U1.63 ; U21.4 26.64,30.14 26.91,29.87 32.39,29.87 32.84,29.42 C4.2 ; H1#2.7 2.96,31.06 C3.1 ; U1.61 59.12,56.24 59.12,61.71 U1.61
  vias: v1(4.11,68.63) v1(4.12,67.94) v1(4.73,68.69) v1(4.73,67.97) v1(4.95,110.02) v1(4.98,109.33) v1(5.59,110.08) v1(5.58,109.36) v1(7.6,20.18) v1(7.62,19.49) v1(8.22,19.52) v1(8.23,20.24) v1(9.83,20.04) v1(9.85,19.35) v1(10.2,102.41) v1(10.22,101.72) v1(10.5,98.98) v1(10.52,98.29) v1(10.46,20.1) v1(10.45,19.38) v1(10.81,101.75) v1(10.83,102.47) v1(11.11,98.32) v1(11.12,99.04) v1(11.85,20.08) v1(11.87,19.39) v1(12.48,20.14) v1(12.47,19.42) v1(12.53,102.34) v1(12.56,101.65) v1(12.64,98.98) v1(12.66,98.29) v1(13.17,102.4) v1(13.16,101.68) v1(13.27,99.04) v1(13.25,98.32) v1(13.88,20.08) v1(13.9,19.39) v1(14.51,20.14) v1(14.5,19.42) v1(16.06,20.08) v1(16.08,19.39) v1(16.69,20.14) v1(16.68,19.42) v1(17.32,62.12) v1(17.34,61.43) v1(17.72,64.72) v1(17.74,64.03) v1(17.95,62.18) v1(17.94,61.46) v1(18.35,64.78) v1(18.34,64.06) v1(18.63,20.08) v1(18.65,19.39) v1(19.26,20.14) v1(19.25,19.42) v1(19.63,68.74) v1(19.65,68.05) v1(19.96,63.32) v1(19.98,62.63) v1(19.94,61.12) v1(19.96,60.43) v1(20.26,68.8) v1(20.25,68.08) v1(20.59,63.38) v1(20.58,62.66) v1(20.57,61.18) v1(20.56,60.46) v1(20.65,59.32) v1(20.67,58.63) v1(20.85,20.13) v1(20.87,19.44) v1(21.28,59.38) v1(21.27,58.66) v1(21.37,64.77) v1(21.39,64.08) v1(21.48,20.19) v1(21.47,19.47) v1(22,64.83) v1(21.99,64.11) v1(22.98,20.13) v1(23,19.44) v1(23.19,58.55) v1(23.21,57.86) v1(23.61,20.19) v1(23.6,19.47) v1(23.81,57.89) v1(23.82,58.61) v1(28.56,29.02) v1(28.58,28.33) v1(29.19,29.08) v1(29.18,28.36) v1(32.81,43.33) v1(32.83,42.64) v1(33.44,43.39) v1(33.43,42.67) v1(34.21,52.53) v1(34.23,51.84) v1(34.23,36.15) v1(34.25,35.46) v1(34.85,52.59) v1(34.83,51.87) v1(34.86,36.21) v1(34.85,35.49) v1(35.56,26.77) v1(35.58,26.08) v1(36.19,26.83) v1(36.18,26.11) v1(36.7,77.91) v1(36.73,77.22) v1(37.1,80.12) v1(37.11,79.43) v1(37.23,75.93) v1(37.26,75.24) v1(37.33,77.97) v1(37.33,77.25) v1(37.48,87.88) v1(37.51,87.19) v1(37.58,90.12) v1(37.61,89.43) v1(37.71,79.46) v1(37.73,80.18) v1(37.86,75.99) v1(37.86,75.27) v1(38.11,87.94) v1(38.11,87.22) v1(38.21,90.18) v1(38.2,89.46) v1(38.95,78.07) v1(38.96,77.38) v1(39.27,75.64) v1(39.3,74.95) v1(39.39,90.22) v1(39.42,89.53) v1(39.39,87.85) v1(39.42,87.16) v1(39.48,80.22) v1(39.49,79.53) v1(39.58,78.13) v1(39.57,77.41) v1(39.91,75.7) v1(39.89,74.98) v1(40.02,89.56) v1(40.02,87.19) v1(40.02,90.28) v1(40.02,87.91) v1(40.11,80.28) v1(40.1,79.56) v1(40.35,52.03) v1(40.36,51.34) v1(40.86,112.74) v1(40.89,112.05) v1(40.92,107.65) v1(40.93,106.96) v1(40.98,52.09) v1(40.96,51.37) v1(41.29,77.68) v1(41.3,76.99) v1(41.49,112.8) v1(41.48,112.08) v1(41.48,75.67) v1(41.51,74.98) v1(41.55,107.71) v1(41.54,106.99) v1(41.59,39.31) v1(41.61,38.62) v1(41.73,90.26) v1(41.76,89.57) v1(41.82,79.89) v1(41.89,87.78) v1(41.92,87.09) v1(41.83,79.2) v1(41.92,77.74) v1(41.91,77.02) v1(41.89,20.42) v1(41.91,19.73) v1(42.02,30.12) v1(42.11,75.73) v1(42.11,75.01) v1(42.04,29.43) v1(42.21,38.65) v1(42.27,52.08) v1(42.3,51.39) v1(42.22,39.37) v1(42.36,90.32) v1(42.36,89.6) v1(42.52,87.12) v1(42.45,79.95) v1(42.43,79.23) v1(42.52,20.48) v1(42.51,19.76) v1(42.52,87.84) v1(42.65,30.18) v1(42.64,29.46) v1(42.73,25.99) v1(42.75,25.3) v1(42.91,52.14) v1(42.89,51.42) v1(43.07,77.88) v1(43.08,77.19) v1(43.3,112.77) v1(43.29,107.58) v1(43.3,106.89) v1(43.33,112.08) v1(43.36,26.05) v1(43.35,25.33) v1(43.7,77.94) v1(43.68,77.22) v1(43.79,75.65) v1(43.8,74.96) v1(43.92,107.64) v1(43.91,106.92) v1(43.88,90.22) v1(43.89,89.53) v1(43.93,112.83) v1(43.92,112.11) v1(44.05,87.88) v1(44.07,87.19) v1(44.2,52.08) v1(44.23,51.39) v1(44.42,75.71) v1(44.41,74.99) v1(44.51,90.28) v1(44.49,89.56) v1(44.67,87.94) v1(44.67,87.22) v1(44.83,52.14) v1(44.83,51.42) v1(45.61,77.65) v1(45.63,76.96) v1(45.79,88.05) v1(45.8,87.36) v1(45.86,107.71) v1(45.88,107.02) v1(45.92,90.65) v1(45.93,89.96) v1(46.08,112.84) v1(46.1,112.15) v1(46.07,75.7) v1(46.08,75.01) v1(46.23,77.71) v1(46.23,76.99) v1(46.42,88.11) v1(46.41,87.39) v1(46.48,107.77) v1(46.48,107.05) v1(46.55,90.71) v1(46.54,89.99) v1(46.52,52.13) v1(46.55,51.44) v1(46.7,112.9) v1(46.7,112.18) v1(46.7,75.76) v1(46.68,75.04) v1(46.64,73.53) v1(46.66,72.84) v1(47.16,52.19) v1(47.14,51.47) v1(47.27,73.59) v1(47.26,72.87) v1(47.86,88.11) v1(47.89,87.42) v1(47.92,90.36) v1(47.95,89.67) v1(48.49,88.17) v1(48.48,87.45) v1(48.55,90.42) v1(48.55,89.7) v1(48.66,73.11) v1(48.67,72.42) v1(48.8,107.91) v1(48.83,107.22) v1(49.2,112.84) v1(49.23,112.15) v1(49.29,73.17) v1(49.27,72.45) v1(49.43,107.97) v1(49.42,107.25) v1(49.7,88.02) v1(49.8,90.39) v1(49.73,87.33) v1(49.83,112.9) v1(49.83,112.18) v1(49.83,89.7) v1(50.33,88.08) v1(50.33,87.36) v1(50.38,52.31) v1(50.39,51.62) v1(50.43,90.45) v1(50.42,89.73) v1(51.01,52.37) v1(50.99,51.65) v1(51.05,107.91) v1(51.07,107.22) v1(51.67,107.97) v1(51.67,107.25) v1(51.82,30.19) v1(51.84,29.5) v1(52.01,112.8) v1(52.02,26.23) v1(52.02,112.11) v1(52.04,25.54) v1(52.17,20.62) v1(52.19,19.93) v1(52.27,73.27) v1(52.29,72.58) v1(52.45,30.25) v1(52.44,29.53) v1(52.64,112.86) v1(52.63,112.14) v1(52.65,26.29) v1(52.64,25.57) v1(52.73,52.18) v1(52.76,51.49) v1(52.8,20.68) v1(52.79,19.96) v1(52.89,73.33) v1(52.89,72.61) v1(53.32,91.06) v1(53.33,90.37) v1(53.38,88.47) v1(53.39,87.78) v1(53.36,52.24) v1(53.36,51.52) v1(53.95,91.12) v1(53.93,90.4) v1(54.01,88.53) v1(53.99,87.81) v1(54.21,42.54) v1(54.21,40.4) v1(54.21,38.58) v1(54.24,44.48) v1(54.26,43.79) v1(54.23,41.85) v1(54.23,39.71) v1(54.23,37.89) v1(54.61,73.31) v1(54.63,72.62) v1(54.77,112.8) v1(54.8,112.11) v1(54.87,44.54) v1(54.86,43.82) v1(54.84,42.6) v1(54.83,41.88) v1(54.84,40.46) v1(54.83,39.74) v1(54.84,38.64) v1(54.83,37.92) v1(55.2,107.91) v1(55.21,107.22) v1(55.16,52.18) v1(55.17,51.49) v1(55.23,73.37) v1(55.23,72.65) v1(55.41,112.86) v1(55.39,112.14) v1(55.6,91.3) v1(55.61,90.61) v1(55.55,88.6) v1(55.58,87.91) v1(55.82,107.25) v1(55.79,52.24) v1(55.77,51.52) v1(55.83,107.97) v1(56.21,90.64) v1(56.18,88.66) v1(56.17,87.94) v1(56.23,91.36) v1(57.07,82.66) v1(57.08,81.97) v1(57.27,112.85) v1(57.3,112.16) v1(57.48,107.98) v1(57.49,107.29) v1(57.6,91.3) v1(57.61,90.61) v1(57.7,82.72) v1(57.68,82) v1(57.77,88.58) v1(57.8,87.89) v1(57.77,73.18) v1(57.8,72.49) v1(57.91,112.91) v1(57.89,112.19) v1(57.83,52.13) v1(57.85,51.44) v1(58.11,108.04) v1(58.1,107.32) v1(58.21,90.64) v1(58.23,91.36) v1(58.29,86.6) v1(58.3,85.91) v1(58.41,88.64) v1(58.39,87.92) v1(58.41,73.24) v1(58.39,72.52) v1(58.45,52.19) v1(58.45,51.47) v1(58.73,82.84) v1(58.74,82.15) v1(58.92,86.66) v1(58.91,85.94) v1(59.36,82.9) v1(59.35,82.18) v1(59.99,88.86) v1(60.02,88.17) v1(60.17,52.2) v1(60.18,51.51) v1(60.27,91.17) v1(60.3,90.48) v1(60.48,86.66) v1(60.51,85.97) v1(60.61,88.2) v1(60.63,88.92) v1(60.63,82.66) v1(60.64,81.97) v1(60.8,52.26) v1(60.79,51.54) v1(60.91,91.23) v1(60.89,90.51) v1(61.11,86.72) v1(61.11,86) v1(61.26,82.72) v1(61.24,82) v1(61.77,88.84) v1(61.8,88.15) v1(61.89,91.32) v1(61.91,90.63) v1(62.41,88.9) v1(62.39,88.18) v1(62.39,73.06) v1(62.41,72.37) v1(62.36,52.17) v1(62.38,51.48) v1(62.52,91.38) v1(62.51,90.66) v1(63.02,73.12) v1(63.01,72.4) v1(62.98,52.23) v1(62.98,51.51) v1(64.52,52.32) v1(64.54,51.63) v1(65.14,52.38) v1(65.14,51.66) v1(65.13,45.13) v1(65.15,44.44) v1(65.71,45.16) v1(65.75,44.47) v1(67.1,44.8) v1(67.12,44.11) v1(67.73,44.86) v1(67.72,44.14) v1(68.71,44.82) v1(68.73,44.13) v1(69.34,44.88) v1(69.33,44.16) v1(75.25,64.35) v1(75.27,63.66) v1(75.38,58.51) v1(75.4,57.82) v1(75.8,88.59) v1(75.83,87.9) v1(75.88,64.41) v1(75.87,63.69) v1(76.01,58.57) v1(76,57.85) v1(76.43,88.65) v1(76.42,87.93) v1(76.6,42.81) v1(76.62,42.12) v1(76.82,81.57) v1(76.89,84.15) v1(76.91,83.46) v1(76.83,80.88) v1(76.97,58.6) v1(76.99,57.91) v1(77.23,42.87) v1(77.22,42.15) v1(77.52,84.21) v1(77.51,83.49) v1(77.45,81.63) v1(77.43,80.91) v1(77.6,58.66) v1(77.59,57.94) v1(78.55,58.99) v1(78.57,58.3) v1(78.87,42.87) v1(78.89,42.18) v1(79.12,63.72) v1(79.14,63.03) v1(79.18,59.05) v1(79.17,58.33) v1(79.5,42.93) v1(79.49,42.21) v1(79.53,40.37) v1(79.55,39.68) v1(79.75,63.78) v1(79.74,63.06) v1(79.77,54.51) v1(79.8,53.82) v1(80.16,40.43) v1(80.15,39.71) v1(80.41,54.57) v1(80.39,53.85) v1(84.82,99.68) v1(84.83,98.99) v1(85.45,99.74) v1(85.43,99.02) v1(85.7,103.12) v1(85.73,102.43) v1(85.77,58.47) v1(85.79,57.78) v1(86.33,103.18) v1(86.33,102.46) v1(86.39,58.53) v1(86.39,57.81) v1(86.93,99.64) v1(86.95,98.95) v1(87.05,103.08) v1(87.08,102.39) v1(87.57,99.7) v1(87.55,98.98) v1(87.68,103.14) v1(87.67,102.42) v1(88.45,103.03) v1(88.46,102.34) v1(89.08,103.09) v1(89.07,102.37) v1(90.05,102.99) v1(90.08,102.3) v1(90.68,103.05) v1(90.67,102.33) v1(92.74,58.1) v1(92.77,57.41) v1(92.86,60.02) v1(92.88,59.33) v1(92.85,56.01) v1(92.86,55.32) v1(92.98,62.79) v1(93.01,62.1) v1(93.38,58.16) v1(93.36,57.44) v1(93.48,60.08) v1(93.48,59.36) v1(93.48,56.07) v1(93.46,55.35) v1(93.61,62.85) v1(93.61,62.13) v1(94.04,22.53) v1(94.06,21.84) v1(94.54,56.07) v1(94.55,55.38) v1(94.67,22.59) v1(94.66,21.87) v1(95.17,56.13) v1(95.16,55.41) v1(97.61,48.9) v1(97.63,48.21) v1(98.24,48.96) v1(98.23,48.24) v2(62.63,26.71) v2(62.67,25.94) v2(62.69,25.3) v2(62.67,24.62) v2(62.77,23.86) v2(63.35,23.74) v2(63.84,29.55) v2(63.85,28.78) v2(63.86,28.13) v2(63.93,23.75) v2(64.17,40.49) v2(64.17,39.83) v2(64.2,39.14) v2(64.16,38.44) v2(64.16,37.75) v2(64.5,29.82) v2(64.63,23.72) v2(64.83,40.49) v2(64.83,39.83) v2(64.86,39.14) v2(64.82,38.44) v2(64.82,37.75) v2(65.2,29.82) v2(65.17,23.72) v2(65.46,40.47) v2(65.46,39.81) v2(65.49,39.12) v2(65.45,38.42) v2(65.45,37.73) v2(65.73,23.72) v2(66.49,23.72) v2(67.14,23.67) v2(67.77,23.64) v2(68.16,30.3) v2(68.16,29.62) v2(68.15,28.67) v2(68.47,23.64)
(no net): length 238.2
  Top Layer w0.152: U1.44 37.59,57.57 U1.44 ; U1.57 54.16,56.12 54.16,61.85 U1.57 ; U1.48 42.67,57.57 U1.48 ; U1.38 U1.38 ; U1.52 47.75,57.57 U1.52 ; U1.43 37.53,55.04 36.43,56.14 36.43,61.9 U1.43 ; U1.33 71.66,100.73 79.63,100.73 U1.33 ; U1.18 29.61,94.9 28.88,95.62 20.56,95.62 U1.18 ; U1.35 71.8,98.33 79.49,98.33 U1.35 ; U1.14 20.81,100.96 28.06,100.96 29.35,99.67 U1.14 ; U1.25 80.7,109.85 80.7,110.58 80.13,111.15 71.92,111.15 U1.25 ; U1.42 35.05,57.57 U1.42 ; U1.55 51.61,61.84 51.61,56.13 U1.55 ; U1.65 64.27,56.17 64.27,61.8 U1.65 ; U1.39 71.76,93.21 79.83,93.21 80.69,92.36 U1.39 ; U1.60 57.91,57.57 U1.60 ; U1.30 U1.30 ; U1.22 U1.22 ; U1.27 80.69,108.05 80.15,108.58 71.89,108.58 U1.27 ; U1.45 39.04,61.97 39.04,55.71 39.78,54.97 U1.45 ; U1.37 71.9,95.89 80.16,95.89 80.69,95.37 U1.37 ; U1.5 U1.5 ; U1.12 29.61,102.34 28.69,103.26 20.57,103.26 U1.12 ; U1.23 71.88,113.65 79.41,113.65 U1.23 ; U1.47 41.46,61.85 41.46,56.12 U1.47 ; U1.54 50.23,60.46 U1.54 ; U1.66 65.53,57.57 U1.66 ; U1.59 56.73,56.09 56.73,61.88 U1.59 ; U1.11 U1.11 ; U1.58 55.37,57.57 U1.58
  Top Layer w0.3: U1.69 U1.70 70.61,57.57 U1.70 U1.69 ; U1.1 U1.1
595DS: length 61.4
  Top Layer w0.152: v2(35.79,111.24) 28.2,111.24 U1.3 U1.3 ; v2(35.8,102.95) 35.8,93.55 36.89,92.46 51.94,92.46 52.09,92.31 52.09,82.16 52.92,81.34 U19.14
  Bottom Layer w0.152: v2(35.8,102.95) 35.79,102.96 v2(35.79,111.24)
595SHCP: length 49.7
  Top Layer w0.152: U1.20 20.56,93.08 28.58,93.08 U1.20 51.53,92.05 51.68,91.9 51.68,78.19 52.35,77.53 U19.11
595STCP: length 39.6
  Top Layer w0.152: U19.12 54.37,78.82 59.61,78.82 59.98,78.45 59.98,71.23 59.65,70.9 v2(50.34,70.9) ; v2(50.32,66.01) 50.32,63.09 U1.53 49.2,61.97 49.2,56 U1.53
  Bottom Layer w0.152: v2(50.34,70.9) 50.32,70.88 v2(50.32,66.01)
BEEP: length 61
  Top Layer w0.152: U1.15 U1.15 28.13,96.07 34.34,96.07 34.69,95.72 34.69,93.16 ; 33.65,50.5 R41.2 33.01,50.46 32.5,50.97 32.5,64.88 33.25,65.63 v2(34.35,65.63) ; v2(34.72,90.78) 34.72,73.58 v2(34.33,73.19)
  Bottom Layer w0.152: v2(34.33,73.19) 34.33,65.65 v2(34.35,65.63) ; v2(34.7,93.16) 34.7,90.8 v2(34.72,90.78)
DC5V: length 20.2
  Top Layer w0.5: C8.2 59.27,36.02 58.63,35.38 58.63,21.56 58.84,21.35 C15.2
EN: length 12.6
  Top Layer w0.152: U34.5 66.21,29.65 v2(66.09,29.77) ; R70.2 74.19,33.72 72.44,33.72 72.44,33.01 v2(72.43,33)
  Bottom Layer w0.152: v2(72.43,33) 72.42,32.99 72.42,31.31 72.14,31.03 66.44,31.03 66.09,30.68 v2(66.09,29.77)
ENUV: length 6.1
  Top Layer w0.152: R63.2 58.31,37.91 R64.1 58.79,39.83 59.49,39.13 62.17,39.13 U28.3
FB: length 8.5
  Top Layer w0.152: C13.1 62.41,30.29 R67.1 ; C13.1 65.91,30.38 66.13,30.6 U34.4 ; C13.1 62.5,30.38 R68.2
KEY1: length 125
  Top Layer w0.152: KEY1.3 KEY1.4 39.14,32.05 R54.2 39.13,34.09 39.13,35.49 40.04,36.4 40.04,48.04 38.65,49.43 38.65,65.91 40.1,67.36 67.8,67.36 68.5,68.06 68.5,110.53 69.09,111.12 71.07,111.12 72.32,112.37 U1.24 U1.24
KEY2: length 109.6
  Top Layer w0.152: 46.45,66.14 46.93,66.62 69.42,66.62 69.58,66.77 69.58,100.66 69.87,100.95 71.06,100.95 72.32,102.21 U1.32 U1.32 ; v2(49.12,53.78) 49.13,53.77 R55.2 49.14,34.07 KEY2.4 KEY2.3 ; v2(46.45,64.38) 46.45,66.13
  Bottom Layer w0.152: v2(46.45,64.38) 46.45,54.1 46.77,53.78 v2(49.12,53.78)
KEY3: length 102.3
  Top Layer w0.152: U1.13 U1.13 28.16,98.58 35,98.58 35.3,98.28 35.3,92.72 ; v2(36.23,72.71) 35.32,73.62 v2(35.32,91.37) ; KEY3.3 KEY3.4 39.14,22.38 R56.2 37.74,24.33 37.47,24.6 37.47,36.13 37.86,36.52 39.38,36.52 39.68,36.83 39.68,47.53 38.18,49.03 38.18,53.07 37.9,53.35 v2(36.24,53.35)
  Bottom Layer w0.152: v2(35.31,92.72) 35.31,91.38 v2(35.32,91.37) ; v2(36.24,53.35) 36.24,67.05 36.23,67.06 v2(36.23,72.71)
KEY4: length 49.1
  Top Layer w0.152: 48.4,53.46 48.74,53.12 48.74,35.67 47.47,34.4 47.47,24.59 47.85,24.21 49.01,24.21 R57.2 49.14,24.32 KEY4.4 KEY4.3 ; 46.35,55.48 46.35,54.1 46.84,53.61 48.24,53.61 48.39,53.46 ; U1.50 45.21,57.57 U1.50 45.15,56.69 46.35,55.49
M1_E1: length 89.8
  Top Layer w0.152: 3,102.77 4.32,102.77 5.28,103.72 37.49,103.72 38.02,104.25 38.02,114.24 38.69,114.91 U1.21 71.64,115.94 80.38,115.94 80.69,115.64 U1.21
M1_E2: length 87.6
  Top Layer w0.152: v2(45.2,66.73) 45.21,66.73 U1.49 43.91,61.76 43.91,56.21 U1.49 ; 22.37,90.53 18.56,90.53 18.15,90.94 18.15,99.8 17.71,100.24 3.02,100.24 3,100.27 ; 22.37,90.53 22.85,90.06 22.85,72.56 23.26,72.14 v2(45.22,72.14) ; 22.37,90.53 22.39,90.53
  Bottom Layer w0.152: v2(45.2,66.73) 45.22,66.75 v2(45.22,72.14)
M1_IN1: length 34.6
  Top Layer w0.152: U19.15 52.96,82.61 v2(52.96,82.6)
  Bottom Layer w0.152: v2(52.96,82.6) 50.79,82.6 50.2,83.19 20.3,83.19 U3.14
M1_IN2: length 30.5
  Top Layer w0.152: v2(46.86,83.87) 48.87,83.87 U19.1
  Bottom Layer w0.152: v2(46.86,83.87) 23.19,83.87 22.55,84.51 22.55,85.75 22.17,86.13 20.22,86.13 U3.15
M1_O1: length 34.6
  Bottom Layer w0.762: U3.4 7.28,80.89 7.99,81.6 7.99,106.38 6.61,107.77 3,107.77
M1_O2: length 19.4
  Top Layer w0.762: U3.5 2.65,78.35 1.58,79.42 1.58,93.85 3,95.27
M1_PWM: length 49.6
  Top Layer w0.152: U1.41 33.35,56.61 33.35,61.36 U1.41 35.05,67.17 v2(35.04,67.17) ; U3.16 22.34,88.51 22.49,88.36 22.49,71.79 22.87,71.41 v2(35.04,71.41)
  Bottom Layer w0.152: v2(35.04,71.41) v2(35.04,67.17)
M2_E1: length 110.2
  Top Layer w0.152: v2(70.19,95.87) 71,95.87 72.26,97.13 U1.36 U1.36 ; 26.39,68.85 26.39,69.29 27.32,70.22 64.84,70.22 65.21,70.59 v2(65.21,95.86) ; 26.39,68.84 26.39,67.46 25.99,67.06 8.84,67.06 8.22,66.44 8.22,60.07 7.95,59.8 3.04,59.8 3,59.77
  Bottom Layer w0.152: v2(65.21,95.86) 65.22,95.87 v2(70.19,95.87)
M2_E2: length 115.4
  Top Layer w0.152: 26.93,67.73 26.93,67.76 ; 26.93,67.76 26.92,66.91 26.44,66.43 9.11,66.43 8.75,66.07 8.75,57.55 8.42,57.22 3.04,57.22 3,57.27 ; 26.93,67.76 26.93,69.05 27.57,69.69 65.26,69.69 65.74,70.17 65.74,91.88 66.04,92.18 v2(66.04,98.49) ; U1.34 U1.34 72.34,99.67 71.14,98.47 v2(70.13,98.47)
  Bottom Layer w0.152: v2(66.04,98.49) 66.06,98.47 v2(70.13,98.47)
M2_IN1: length 32.8
  Top Layer w0.152: U19.2 48.85,82.63 v2(46.85,82.63)
  Bottom Layer w0.152: 46.84,82.64 v2(46.85,82.63) 22.94,82.63 22.64,82.33 22.64,78.61 22.36,78.33 20.08,78.33 U3.12
M2_IN2: length 33.9
  Top Layer w0.152: v2(46.92,81.33) 46.92,81.34 U19.3
  Bottom Layer w0.152: U3.11 20.08,75.79 22.76,75.79 23.17,76.2 23.17,80.9 23.6,81.33 v2(46.92,81.33)
M2_O1: length 17.1
  Top Layer w0.762: U3.6 6.25,75.81 6.92,75.14 6.92,65.29 6.39,64.77 3,64.77
M2_O2: length 24.6
  Top Layer w0.762: 3,52.27 2.95,52.31 2.07,52.31 1.22,53.16 1.22,72.51 1.98,73.27 U3.7
M2_PWM: length 46.5
  Top Layer w0.152: U1.51 46.66,56 46.66,61.97 U1.51 47.75,66.07 v2(47.75,66.07) ; v2(47.74,70.8) 22.45,70.8 22.06,71.19 22.06,73.12 21.91,73.27 20.06,73.27 U3.10
  Bottom Layer w0.152: v2(47.74,70.8) 47.75,70.79 v2(47.75,66.07)
M3_E1: length 87.2
  Top Layer w0.152: v2(38.77,109.86) 63.19,109.86 63.53,109.52 63.53,101.1 63.71,100.92 ; v2(37.35,109.83) 37.35,109.83 U1.6 28.58,110.86 20.56,110.86 U1.6
  Bottom Layer w0.152: v2(37.35,109.83) 38.74,109.83 v2(38.77,109.86) ; v2(63.71,100.89) 63.85,100.75 96.53,100.75 97,100.28
M3_E2: length 91.9
  Top Layer w0.152: U1.10 20.56,105.78 28.58,105.78 U1.10 37.23,104.75 v2(37.23,104.75) ; v2(39.41,104.68) 39.41,109.12 39.69,109.4 62.52,109.4 62.99,108.93 v2(62.99,101.52)
  Bottom Layer w0.152: v2(62.99,101.52) 64.09,101.52 64.49,101.12 96.25,101.12 97,101.87 97,102.78 ; v2(37.23,104.75) 37.22,104.76 37.22,104.77 39.32,104.77 v2(39.41,104.68)
M3_IN1: length 70.8
  Top Layer w0.152: TB6612.14 96.14,83.34 98.51,83.34 98.84,83.67 98.84,90.38 98.32,90.9 72.23,90.9 71.48,90.15 v2(71.48,79.66) ; v2(50.37,79.69) 49.99,80.07 U19.4
  Bottom Layer w0.152: v2(71.48,79.66) 50.4,79.66 v2(50.37,79.69)
M3_IN2: length 65.9
  Top Layer w0.152: TB6612.15 97.42,85.97 97.8,86.35 97.8,90.07 97.38,90.49 72.89,90.49 72.25,89.85 v2(72.25,80.29) ; U19.5 50.85,78.8 51,78.95 51,80.28
  Bottom Layer w0.152: v2(51,80.28) 51.01,80.29 v2(72.25,80.29)
M3_O1: length 30.8
  Top Layer w0.762: v3(85.33,80.86) 85.3,80.89 TB6612.4
  Bottom Layer w0.762: v3(85.33,80.86) 93.05,80.86 93.51,81.32 93.51,94.66 94.21,95.36 96.92,95.36 97,95.28
M3_O2: length 43.5
  Top Layer w0.762: v3(83.21,78.36) 83.2,78.35 TB6612.5 ; v3(94.87,99.27) 94.87,106.98 95.63,107.74 96.96,107.74 97,107.78
  Bottom Layer w0.762: v3(94.87,99.27) 92.14,96.54 92.14,83.83 91.42,83.11 83.86,83.11 83.21,82.46 v3(83.21,78.36)
M3_PWM: length 75.3
  Top Layer w0.152: v2(61.05,71.18) 61.05,79.03 61.06,79.04 ; v2(73.14,79.08) 73.14,89.35 73.65,89.86 95.8,89.86 96.08,89.58 96.08,88.53 TB6612.16 ; U1.56 52.83,57.57 U1.56 52.83,61.34 54.2,62.71 54.2,65.44 54.68,65.92 60.96,65.92 v2(61.06,66.02)
  Bottom Layer w0.152: v2(61.05,71.18) 61.06,71.17 v2(61.06,66.02) ; v2(61.06,79.08) v2(73.14,79.08)
M4_E1: length 74
  Top Layer w0.152: 97,57.28 96.98,57.26 94.91,57.26 94.48,57.69 94.48,66.29 93.65,67.12 71.19,67.12 70.24,66.16 v2(70.24,65.43) ; v2(41.99,65.41) 41.41,64.83 41.41,62.57 40.13,61.29 U1.46 40.07,60.46 U1.46
  Bottom Layer w0.152: v2(41.99,65.41) 42.01,65.43 v2(70.24,65.43)
M4_E2: length 82.8
  Top Layer w0.152: v2(70.35,67.22) 70.6,67.47 94.24,67.47 95,66.71 95,60.24 95.32,59.92 96.86,59.92 97,59.78 ; U1.31 80.57,102.33 80.57,103.09 80.31,103.35 71.74,103.35 U1.31 69.61,102.21 68.96,101.56 v2(68.96,67.26)
  Bottom Layer w0.152: v2(70.35,67.22) 69,67.22 v2(68.96,67.26)
M4_IN1: length 72.1
  Top Layer w0.152: U19.6 50.63,77.53 v2(50.63,77.52) ; v2(71.54,77.45) 71.54,68.4 71.79,68.15 98.92,68.15 99.07,68.3 99.07,77.74 98.46,78.35 TB6612.12
  Bottom Layer w0.152: v2(71.54,77.45) 50.7,77.45 v2(50.63,77.52)
M4_IN2: length 66.6
  Top Layer w0.152: v2(72.39,76.13) 72.39,68.76 72.64,68.51 98.41,68.51 98.57,68.66 98.57,75.21 97.93,75.85 96.1,75.85 TB6612.11 ; U19.7 50.52,76.26 v2(50.52,76.25)
  Bottom Layer w0.152: v2(72.39,76.13) 50.64,76.13 v2(50.52,76.25)
M4_O1: length 39.7
  Top Layer w0.762: TB6612.6 82.39,75.81 v3(82.97,75.23)
  Bottom Layer w0.762: 97,52.23 96.97,52.2 83.9,52.2 82.97,53.13 v3(82.97,75.23)
M4_O2: length 25.1
  Top Layer w0.762: v3(85.22,73.27) 85.22,73.27 TB6612.7
  Bottom Layer w0.762: 97,64.73 96.98,64.71 85.93,64.71 85.22,65.42 v3(85.22,73.27)
M4_PWM: length 123.2
  Top Layer w0.152: v2(36.5,107.29) 36.5,107.29 U1.8 28.24,108.66 20.89,108.66 U1.8 ; v2(72.97,75.38) 72.97,69.11 73.22,68.86 97.81,68.86 97.96,69.01 97.96,72.82 97.51,73.27 TB6612.10 ; v2(36.5,102.54) 36.5,93.49 37.17,92.82 63.49,92.82 63.86,92.45 v2(63.86,75.38)
  Bottom Layer w0.152: v2(36.5,107.29) 36.5,102.98 36.51,102.97 36.51,102.55 v2(36.5,102.54) ; v2(63.86,75.38) v2(72.97,75.38)
OLED_CS: length 137.1
  Top Layer w0.152: U1.29 80.69,105.68 80.31,106.05 71.9,106.05 U1.29 ; U11.7 22.66,26.05 22.66,32.83 23.09,33.26 28.33,33.26 28.86,33.79 28.88,67.24 29.45,67.82 67.27,67.82 67.82,68.36 67.82,104.6 v2(67.97,104.75)
  Bottom Layer w0.152: U1.29 67.97,104.75 v2(67.97,104.75)
OLED_DC: length 139.8
  Top Layer w0.152: U1.26 U1.26 72.32,109.83 71.13,108.64 v2(69.79,108.64) ; U11.6 20.17,33.26 20.56,33.65 27.84,33.65 28.47,34.28 28.47,67.6 29.04,68.17 66.81,68.17 67.44,68.8 67.44,108.56 v2(67.44,108.56)
  Bottom Layer w0.152: v2(67.44,108.56) 67.52,108.64 v2(69.79,108.64)
OLED_RST: length 124.6
  Top Layer w0.152: U11.5 17.63,33.56 18.08,34.01 27.57,34.01 28.09,34.53 28.09,68.01 28.71,68.63 66.34,68.63 66.88,69.17 v2(66.88,90.75) ; U1.40 U1.40 72.33,92.05 71.03,90.75 v2(70.52,90.75)
  Bottom Layer w0.152: v2(70.52,90.75) v2(66.88,90.75)
OLED_SCL: length 103.3
  Top Layer w0.152: v2(25.48,65.55) 25.48,65.56 26.82,65.56 27.19,65.19 27.19,35.24 26.67,34.72 13.04,34.72 12.49,34.17 12.49,26.07 U11.3 ; U1.16 28.58,98.16 20.56,98.16 U1.16 ; v2(25.46,91.28) v2(25.46,73.1)
  Bottom Layer w0.152: v2(25.46,91.28) 25.46,97.98 25.73,98.25 28.49,98.25 U1.16 ; v2(25.48,65.55) 25.46,65.57 v2(25.46,73.1)
OLED_SDA: length 143.4
  Top Layer w0.152: U11.4 15.09,33.84 15.61,34.36 27.28,34.36 27.69,34.77 27.69,68.59 28.25,69.15 65.88,69.15 66.33,69.6 66.33,91.29 66.83,91.79 v2(66.83,107.01) ; v2(69.19,107.01) 69.99,106.21 71.24,106.21 72.32,107.29 U1.28 U1.28
  Bottom Layer w0.152: v2(66.83,107.01) v2(69.19,107.01)
OVP: length 16.3
  Top Layer w0.152: v2(69.12,41.36) 68.79,41.69 U28.8 ; R65.2 58.31,43.34 R64.2 58.29,41.35 v2(57.39,41.35)
  Bottom Layer w0.152: v2(57.39,41.35) 69.11,41.35 v2(69.12,41.36)
RX1: length 74.7
  Top Layer w0.152: U1.19 U1.19 27.07,91.41 27.59,90.88 33.22,90.88 33.47,90.63 33.47,75.03 32.91,74.47 v2(32.91,73.21) ; v2(32.76,66.89) 31.59,66.89 30.97,66.27 30.97,33.68 30.55,33.26 29.47,33.26 29.16,32.95 29.16,31.4 U21.3
  Bottom Layer w0.152: 32.76,67.37 32.76,73.06 v2(32.91,73.21) ; 32.76,67.36 v2(32.76,66.89)
SCL1: length 84.4
  Top Layer w0.152: U1.62 60.45,57.57 U1.62 60.45,61.49 61.9,62.94 61.9,66.04 v2(61.91,66.05) ; R7.2 92.2,110.25 U18.3 ; v2(65.38,110.79) 64.6,110.01 64.6,94.6 64.75,94.45 64.75,70.92 64.59,70.76 v2(61.89,70.76) 61.89,70.8 61.9,70.81
  Bottom Layer w0.152: v2(65.38,110.79) 65.53,110.94 87.98,110.94 U18.3 ; v2(61.91,66.05) 61.89,66.07 v2(61.89,70.76)
SCL2: length 108.5
  Top Layer w0.152: H1#2.5 4.18,37.25 R9.2 5.8,37.3 6.05,37.05 6.05,34.99 6.33,34.71 H1.6 9.09,35.38 25.82,35.38 25.98,35.53 25.98,63.94 v2(26.23,64.19) ; U1.7 U1.7 ; v2(23.89,73.41) 23.89,90.33 24.24,90.68 v2(24.66,90.68)
  Bottom Layer w0.152: v2(26.23,64.19) 26.22,64.18 24.75,64.18 24.08,64.86 24.08,73.23 v2(23.89,73.41) ; U1.7 24.36,107.29 24.66,106.99 v2(24.66,90.68)
SDA1: length 83.3
  Top Layer w0.152: R8.2 92.15,112.75 U18.4 ; U1.64 62.99,57.57 U1.64 62.99,61.44 64.18,62.63 64.18,66.01 v2(64.19,66.02) ; v2(64.83,111.37) 64.24,110.78 64.24,94.26 64.39,94.11 64.39,71.72 v2(64.2,71.52)
  Bottom Layer w0.152: v2(64.19,66.02) 64.19,71.51 v2(64.2,71.52) ; U18.4 88.67,112.08 87.89,111.3 65.9,111.3 65.72,111.48 64.94,111.48 v2(64.83,111.37)
SDA2: length 103.3
  Top Layer w0.152: H1#2.6 4.22,34.71 R10.2 4.28,34.77 v2(5.45,34.77) ; v2(25.62,64.74) 25.62,36.13 25.33,35.84 9.83,35.84 H1.5 ; v2(24.62,89.66) 24.62,73.43 v2(24.63,73.42) ; U1.9 U1.9
  Bottom Layer w0.152: v2(25.62,64.74) 24.96,64.74 24.43,65.27 24.43,73.22 v2(24.63,73.42) ; v2(24.62,89.66) 23.88,90.4 23.88,104.6 23.73,104.75 U1.9 ; v2(5.45,34.77) 5.68,35 5.68,36.93 6,37.25 H1.5
SW:
  vias: v2(69.86,27.52) v2(69.88,26.93) v2(69.86,26.34) v2(70.06,29.65) v2(70.52,27.52) v2(70.52,26.92) v2(70.49,26.33) v2(70.62,29.65) v2(71.18,29.66) v2(71.17,27.52) v2(71.18,26.93) v2(71.17,26.34) v2(71.86,27.49) v2(71.86,26.89) v2(71.83,26.3) v2(72.52,27.49) v2(72.52,26.31) v2(72.52,26.9)
TX1: length 76.4
  Top Layer w0.152: v2(33.61,73.75) 33.98,74.12 v2(33.98,91.38) ; U21.2 31.64,65.47 32.36,66.19 33.77,66.19 v2(33.78,66.18) ; U1.17 U1.17 28.15,93.51 33.83,93.51 33.99,93.35 v2(33.99,92.77)
  Bottom Layer w0.152: v2(33.78,66.18) 33.78,73.58 v2(33.61,73.75) ; v2(33.98,91.38) 33.99,91.39 v2(33.99,92.77)
$1N3300: length 3
  Top Layer w0.152: R1.1 20.01,80.84 U3.13
$1N3306: length 3.2
  Top Layer w0.152: TB6612.13 95.96,80.79 R2.1
$1N3954: length 2.5
  Top Layer w0.152: U19.9 56.18,74.99 R3.1
$1N3999: length 2.3
  Top Layer w0.152: R4.1 56.45,76.26 U19.10
$1N4038: length 2.2
  Top Layer w0.152: R5.1 54.36,80.05 U19.13
$1N7178: length 3.4
  Top Layer w0.152: Q1.1 35.55,47.46 35.55,48.94 35.53,48.96 33.69,48.96
$1N9172: length 1.8
  Top Layer w0.152: LED2.2 76.54,36.31 R58.1
$1N14720: length 5.9
  Top Layer w0.152: R45.2 38.44,45.66 BUZZER3.1
$1N14723: length 6.1
  Top Layer w0.152: BUZZER3.2 34.55,40.96 34.55,45.41 Q1.3
$1N15095: length 2
  Top Layer w0.152: LED3.2 86.05,52.27 86.04,52.26
$1N16674: length 1.8
  Top Layer w0.3: U34.6 65.3,28.7 C17.2
$1N17004: length 4
  Top Layer w0.3: 60.53,28.78 R67.2 ; 60.53,28.78 60.4,28.78 ; 60.53,28.78 61.34,28.78 61.74,28.38 C13.2 ; 60.53,28.78 60.52,28.77 R66.1
$1N17013: length 1.9
  Top Layer w0.3: LED1.2 66.17,18.03 66.17,19.86
$1N22095: length 11.9
  Top Layer w0.152: 82.59,37.14 82.55,37.1 82.55,35.76 82.1,35.31 73.37,35.31 73.1,35.58 R60.2
$1N22604: length 2
  Top Layer w0.152: U28.2 62.17,40.4 C10.2
$1N22844: length 7.2
  Top Layer w0.152: 66.98,43.14 69.28,43.14 69.83,42.59 69.83,40.93 69.32,40.42 U28.7
$1N22851: length 29.2
  Top Layer w0.152: v1(69.44,39.14) 69.43,39.15 U28.6 ; 71.32,35.27 71.68,34.91 83.96,34.91 84.28,35.23 84.28,40.71 82.85,42.14 82.59,42.14 ; 71.32,35.27 71.32,36.34 ; 71.32,35.27 71.31,35.28
  Bottom Layer w0.152: v1(69.44,39.14) 70.89,39.14 71.32,38.71 v1(71.32,35.49)

## Copper pours and planes (outline as drawn; the poured copper is in the pictures)
5V on Top Layer: 66.56,38.41 75.51,38.41 75.51,37.25 66.56,37.25
5V on Top Layer: 70.57,47.83 72.5,47.83 72.5,37.24 70.57,37.24
12V on Top Layer: 72.81,32.79 93.58,32.79 93.58,30.22 72.81,30.22
+3.3V on Top Layer: 75.24,52.87 85.77,52.87 85.77,47.02 75.24,47.02
+12V on Top Layer: 94.15,32.48 96.63,32.48 96.63,24.8 94.15,24.8
GND on Top Layer: 57.69,45.35 70.08,45.35 70.08,35.48 57.69,35.48
GND on Top Layer: 74.15,29.65 84.37,29.65 84.37,17.01 74.15,17.01
GND on Top Layer: 77.32,29.71 84.3,29.71 84.3,16.98 77.32,16.98
GND on Top Layer: -13.18,117.86 103.69,117.86 103.69,16.25 -13.18,16.25
GND on Top Layer: 63.49,33.17 83.68,33.17 83.68,28.07 63.49,28.07
GND on Bottom Layer: -13.32,117.4 111.31,117.4 111.31,15.8 -13.32,15.8
DC5V on Top Layer: 59.39,38.33 63.49,38.33 63.49,35.3 59.39,35.3
DC5V on Top Layer: 59.7,26.07 73.81,26.07 73.81,20.37 59.7,20.37
DC12V on Top Layer: 85.11,28.38 92.85,28.38 92.85,17.51 85.11,17.51
SW on Top Layer: 63.86,27.8 73.84,27.8 73.84,23.73 63.86,23.73
SW on Top Layer: 68.93,29.94 71.47,29.94 71.47,29.39 68.93,29.39
SW on Bottom Layer: 69.23,29.92 73.82,29.92 73.82,23.77 69.23,23.77
$1N16686 on Top Layer: 68.85,34.5 71.74,34.5 71.74,30.2 68.85,30.2
$1N17140 on Top Layer: 72.97,47.67 80.05,47.67 80.05,45.78 72.97,45.78

Small or netless copper shapes (teardrops, artwork), in the pictures only: 494 on Top Layer, 159 on Bottom Layer

## Text on the board
Top Silkscreen Layer: 循迹板 | 2.1版 | 3.3V | SCL2 | SDA2 | GND | SCL | SDA | RST | DC | CS | RX | TX | 蜂鸣器 | 报警蜂鸣器 | SDA1 | SCL1 | 5V | M1_02 | M1_E2 | M2_E1 | M2_01 | M1_01 | M1_E1 | M2_02 | M2_E2 | M4_E2 | M4_02 | M3-E2 | M3-02 | M4_E1 | M4_01 | M3-01 | M3-E1 | TB6612 | 电池接口 | 左前 | 左后 | OLED屏幕 | 右后 | 右前 | 开关
